# EasyEDA Pro project ProPrj_HPMDuino_DEV_2025-07-16.epro, schematic Schematic1
Board Name: Board1; Create Date: 2025-06-02; Page Name: P1; Project Name: HPMDuino_DEV; Schematic Name: Schematic1; Update Date: 2025-07-04; Drawed: Flose; Version: 1.0beta
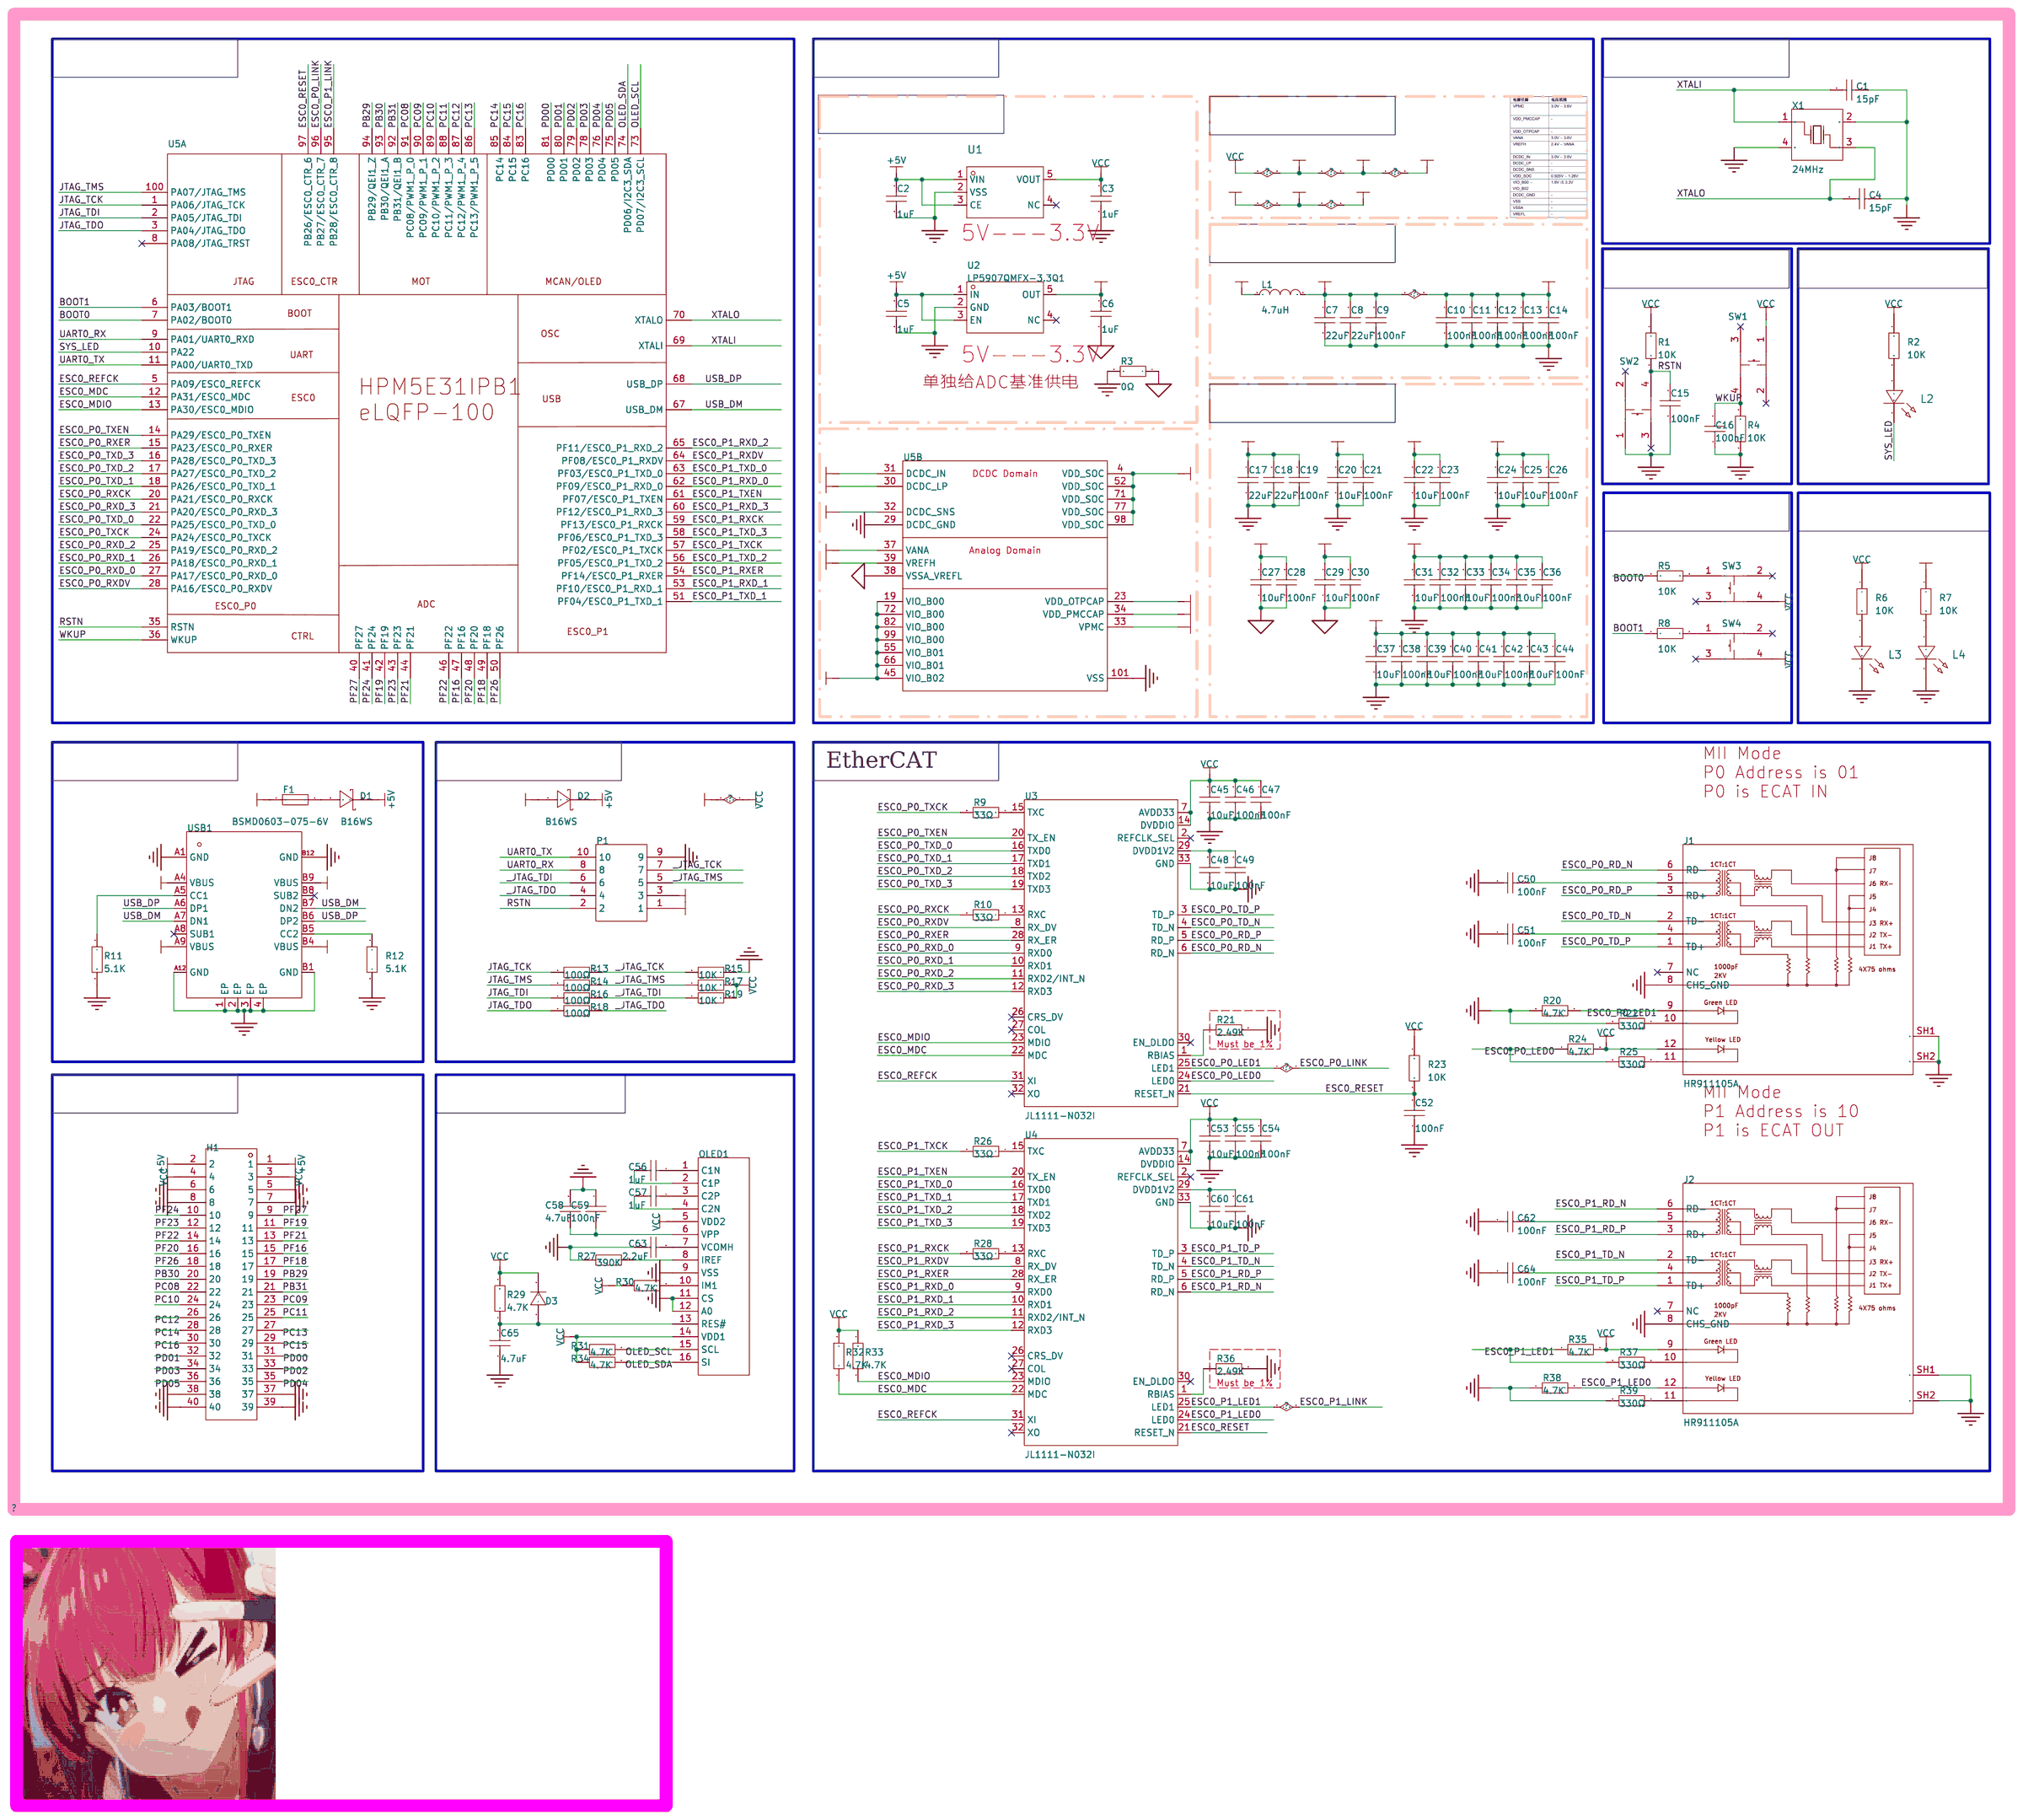
[diagram p0: schematic sheet]

## Parts
C1  15pF  [c0402-无丝印-全尺寸_2]
C2  1uF  [c0402-无丝印-全尺寸_2]
C3  1uF  [c0402-无丝印-全尺寸_2]
C4  15pF  [c0402-无丝印-全尺寸_2]
C5  1uF  [c0402-无丝印-全尺寸_2]
C6  1uF  [c0402-无丝印-全尺寸_2]
C7  22uF  [c0402-无丝印-全尺寸_2]
C8  22uF  [c0402-无丝印-全尺寸_2]
C9  100nF  [c0402-无丝印-全尺寸_2]
C10  100nF  [c0402-无丝印-全尺寸_2]
C11  100nF  [c0402-无丝印-全尺寸_2]
C12  100nF  [c0402-无丝印-全尺寸_2]
C13  100nF  [c0402-无丝印-全尺寸_2]
C14  100nF  [c0402-无丝印-全尺寸_2]
C15  100nF  [c0402-无丝印-全尺寸_2]
C16  100nF  [c0402-无丝印-全尺寸_2]
C17  22uF  [c0402-无丝印-全尺寸_2]
C18  22uF  [c0402-无丝印-全尺寸_2]
C19  100nF  [c0402-无丝印-全尺寸_2]
C20  10uF  [c0402-无丝印-全尺寸_2]
C21  100nF  [c0402-无丝印-全尺寸_2]
C22  10uF  [c0402-无丝印-全尺寸_2]
C23  100nF  [c0402-无丝印-全尺寸_2]
C24  10uF  [c0402-无丝印-全尺寸_2]
C25  10uF  [c0402-无丝印-全尺寸_2]
C26  100nF  [c0402-无丝印-全尺寸_2]
C27  10uF  [c0402-无丝印-全尺寸_2]
C28  100nF  [c0402-无丝印-全尺寸_2]
C29  10uF  [c0402-无丝印-全尺寸_2]
C30  100nF  [c0402-无丝印-全尺寸_2]
C31  10uF  [c0402-无丝印-全尺寸_2]
C32  100nF  [c0402-无丝印-全尺寸_2]
C33  10uF  [c0402-无丝印-全尺寸_2]
C34  100nF  [c0402-无丝印-全尺寸_2]
C35  10uF  [c0402-无丝印-全尺寸_2]
C36  100nF  [c0402-无丝印-全尺寸_2]
C37  10uF  [c0402-无丝印-全尺寸_2]
C38  100nF  [c0402-无丝印-全尺寸_2]
C39  10uF  [c0402-无丝印-全尺寸_2]
C40  100nF  [c0402-无丝印-全尺寸_2]
C41  10uF  [c0402-无丝印-全尺寸_2]
C42  100nF  [c0402-无丝印-全尺寸_2]
C43  10uF  [c0402-无丝印-全尺寸_2]
C44  100nF  [c0402-无丝印-全尺寸_2]
C45  10uF  [c0402-无丝印-全尺寸_2]
C46  100nF  [c0402-无丝印-全尺寸_2]
C47  100nF  [c0402-无丝印-全尺寸_2]
C48  10uF  [c0402-无丝印-全尺寸_2]
C49  100nF  [c0402-无丝印-全尺寸_2]
C50  100nF  [c0402-无丝印-全尺寸_2]
C51  100nF  [c0402-无丝印-全尺寸_2]
C52  100nF  [c0402-无丝印-全尺寸_2]
C53  10uF  [c0402-无丝印-全尺寸_2]
C54  100nF  [c0402-无丝印-全尺寸_2]
C55  100nF  [c0402-无丝印-全尺寸_2]
C56  1uF  [c0402-无丝印-全尺寸_2]
C57  1uF  [c0402-无丝印-全尺寸_2]
C58  4.7uF  [c0402-无丝印-全尺寸_2]
C59  100nF  [c0402-无丝印-全尺寸_2]
C60  10uF  [c0402-无丝印-全尺寸_2]
C61  100nF  [c0402-无丝印-全尺寸_2]
C62  100nF  [c0402-无丝印-全尺寸_2]
C63  2.2uF  [c0402-无丝印-全尺寸_2]
C64  100nF  [c0402-无丝印-全尺寸_2]
C65  4.7uF  [c0402-无丝印-全尺寸_2]
D1  B16WS  [SOD-323_L1.8-W1.3-LS2.5-RD]
D2  B16WS  [SOD-323_L1.8-W1.3-LS2.5-RD]
D3  1N4148WS  [SOD-323_L1.8-W1.3-LS2.5-RD]
F1  BSMD0603-075-6V  [F0603]
H1  -  [HDR-TH_40P-P2.54-V-M-R2-C20-S2.54]
J1  HR911105A  [RJ45-TH_HR911105A]
J2  HR911105A  [RJ45-TH_HR911105A]
L1  4.7uH  [IND-SMD_L2.5-W2.0-VLS252012CX-150M]
L2  NCD0603G1  [LED0603_S]
L3  NCD0603G1  [LED0603_S]
L4  NCD0603G1  [LED0603_S]
OLED1  -  [1.29'OLED-64x128-16P]
P1  2.0-2*5P直简牛  [IDC-TH_10P-P2.00-V-R2-C5-S2.00]
R1  10K  [r0402-无丝印-全尺寸_1]
R2  10K  [r0402-无丝印-全尺寸_1]
R3  0Ω  [r0402-无丝印-全尺寸_1]
R4  10K  [r0402-无丝印-全尺寸_1]
R5  10K  [r0402-无丝印-全尺寸_1]
R6  10K  [r0402-无丝印-全尺寸_1]
R7  10K  [r0402-无丝印-全尺寸_1]
R8  10K  [r0402-无丝印-全尺寸_1]
R9  33Ω  [r0402-无丝印-全尺寸_1]
R10  33Ω  [r0402-无丝印-全尺寸_1]
R11  5.1K  [r0402-无丝印-全尺寸_1]
R12  5.1K  [r0402-无丝印-全尺寸_1]
R13  100Ω  [r0402-无丝印-全尺寸_1]
R14  100Ω  [r0402-无丝印-全尺寸_1]
R15  10K  [r0402-无丝印-全尺寸_1]
R16  100Ω  [r0402-无丝印-全尺寸_1]
R17  10K  [r0402-无丝印-全尺寸_1]
R18  100Ω  [r0402-无丝印-全尺寸_1]
R19  10K  [r0402-无丝印-全尺寸_1]
R20  4.7K  [r0402-无丝印-全尺寸_1]
R21  2.49K  [r0402-无丝印-全尺寸_1]
R22  330Ω  [r0402-无丝印-全尺寸_1]
R23  10K  [r0402-无丝印-全尺寸_1]
R24  4.7K  [r0402-无丝印-全尺寸_1]
R25  330Ω  [r0402-无丝印-全尺寸_1]
R26  33Ω  [r0402-无丝印-全尺寸_1]
R27  390K  [r0402-无丝印-全尺寸_1]
R28  33Ω  [r0402-无丝印-全尺寸_1]
R29  4.7K  [r0402-无丝印-全尺寸_1]
R30  4.7K  [r0402-无丝印-全尺寸_1]
R31  4.7K  [r0402-无丝印-全尺寸_1]
R32  4.7K  [r0402-无丝印-全尺寸_1]
R33  4.7K  [r0402-无丝印-全尺寸_1]
R34  4.7K  [r0402-无丝印-全尺寸_1]
R35  4.7K  [r0402-无丝印-全尺寸_1]
R36  2.49K  [r0402-无丝印-全尺寸_1]
R37  330Ω  [r0402-无丝印-全尺寸_1]
R38  4.7K  [r0402-无丝印-全尺寸_1]
R39  330Ω  [r0402-无丝印-全尺寸_1]
SW1  PTS815SJK250SMTRLFS  [SW-SMD_4P-L4.2-W3.3-P2.15-LS5.1]
SW2  PTS815SJK250SMTRLFS  [SW-SMD_4P-L4.2-W3.3-P2.15-LS5.1]
SW3  PTS815SJK250SMTRLFS  [SW-SMD_4P-L4.2-W3.3-P2.15-LS5.1]
SW4  PTS815SJK250SMTRLFS  [SW-SMD_4P-L4.2-W3.3-P2.15-LS5.1]
U1  XC6210B332MR  [SOT-23-5_L3.0-W1.7-P0.95-LS2.8-BR]
U2  LP5907QMFX-3.3Q1  [SOT-23-5_L3.0-W1.7-P0.95-LS2.8-BR]
U3  JL1111-N032I  [QFN-32_L5.0-W5.0-P0.50-TL-EP3.3]
U4  JL1111-N032I  [QFN-32_L5.0-W5.0-P0.50-TL-EP3.3]
U5  -  [eLQFP-100]  (sections MAIN,PWR)
USB1  KH-TYPE-C-16P  [USB-C-SMD_KH-TYPE-C-16P]
X1  24MHz  [CRYSTAL-SMD_4P-L3.2-W2.5-BL]

## Library data of the parts
C1-C65 = CL05A106MQ5NUNC: 容值:10uF;精度:±20%;额定电压:6.3V;材质(温度系数):X5R;; LCSC Part Name: 10uF ±20% 6.3V; Supplier Part: C15525; Manufacturer: SAMSUNG(三星); Supplier Footprint: 0402; JLCPCB Part Class: Basic Part; Datasheet: https://atta.szlcsc.com/upload/public/pdf/source/20220823/2B02EE04F8F211D38A52DCB16EB6BEBA.pdf; Supplier: LCSC; Tolerance: ±20%; Voltage Rated: 6.3V; Temperature Coefficient: X5R
D1 D2 = B16WS_C364278: 正向压降(Vf):700mV@1A;直流反向耐压(Vr):40V;整流电流:1A;; LCSC Part Name: 电压:40V 电流:1A; Supplier Part: C364278; Manufacturer: MDD(辰达半导体); Supplier Footprint: SOD-323; JLCPCB Part Class: 扩展库; Datasheet: https://atta.szlcsc.com/upload/public/pdf/source/20240729/65CF7652994FB9489B656F4E1141E413.pdf; Supplier: LCSC; Forward Voltage (Vf@If): 700mV@1A; Reverse Voltage (Vr): 40V; Rectified Current: 1A; Reverse Leakage Current (Ir): 100uA@40V
D3 = 1N4148WS_C2128: 二极管配置:独立式;功率:200mW;直流反向耐压(Vr):100V;平均整流电流(Io):150mA;正向压降(Vf):1.25V@150mA;反向电流(Ir):1uA@75V;反向恢复时间(trr):4ns;工作温度:+150℃@(Tj);; LCSC Part Name: 100V 150mA 4ns T4; Supplier Part: C2128; Manufacturer: CJ(江苏长电/长晶); Supplier Footprint: SOD-323; JLCPCB Part Class: 基础库; Datasheet: https://atta.szlcsc.com/upload/public/pdf/source/20140809/1457707208178.pdf; Supplier: LCSC; Diode Configuration: 独立式; Power Dissipation: 200mW; Reverse Voltage (Vr): 100V; Average Rectified Current (Io): 150mA; Forward Voltage (Vf@If): 1.25V@150mA; Reverse Leakage Current: 1uA@75V; Reverse Recovery Time (trr): 4ns; Operating Temperature: +150℃@(Tj)
F1 = BSMD0603-075-6V: 最大电压:6V;最大电流:40A;保持电流:750mA;跳闸电流:1.5A;; LCSC Part Name: 6V 750mA 0603自恢复; Supplier Part: C914092; Manufacturer: BHFUSE(佰宏); Supplier Footprint: 0603; JLCPCB Part Class: 扩展库; Datasheet: https://atta.szlcsc.com/upload/public/pdf/source/20230512/E478DE3555A0061DA0124A9F45802B86.pdf; Supplier: LCSC; Operating Voltage (Max): 6V; Current Rating (Max): 40A; Hold Current: 750mA; Trip Current: 1.5A; Power Dissipation: 500mW; Resistance - Initial (Ri) (Min): 60mΩ; Resistance - Post Trip (R1) (Max): 450mΩ; Maximum Time to Trip: 100ms; Operating Temperature: -40℃~+85℃
H1 = B-2100S40P-B110: 间距:2.54mm;总PIN位数:40;排数:2;插针结构:2x20P;行距:2.54mm;安装类型:直插;圆针/方针:-;额定电流:-;额定电压:-;配合针长度:6mm;塑高:2.54mm;端接针长度:3mm;触头材质:黄铜;触头镀层:-;工作温度范围:-40~+105;颜色:黑色;; LCSC Part Name: 2.54mm 2x20P; Supplier Part: C124383; Manufacturer: Ckmtw(灿科盟); Supplier Footprint: 插件,P=2.54mm; JLCPCB Part Class: Extended Part; Datasheet: https://atta.szlcsc.com/upload/public/pdf/source/20170821/C124383_1503303310291901537.pdf; Supplier: LCSC; Pitch: 2.54mm; Number of Pins: 40; Number of Rows: 2; Pin Structure: 2x20P; Row Spacing: 2.54mm; Mounting Type: 直插; Length of Mating Pin: 6mm; Insulation Height: 2.54mm; Length of End Connection Pin: 3mm; Contact Material: 黄铜; Operating Temperature Range: -40~+105; Color: 黑色
J1 J2 = HR911105A_C12074: 连接器类型:RJ插座;USOC代码:RJ45;端口数量:1;等级:-;屏蔽:-;LED:带LED;; LCSC Part Name: RJ45 带LED 带LED灯; Supplier Part: C12074; Manufacturer: HANRUN(汉仁); Supplier Footprint: 插件; JLCPCB Part Class: 扩展库; Datasheet: https://atta.szlcsc.com/upload/public/pdf/source/20170918/C12074_1505726819496976146.pdf; Supplier: LCSC; Connector Type: RJ插座; USOC Codes: RJ45; Number of Ports: 1; LED: 带LED
L1 = FTC252010S4R7MBCA: 电感值:4.7uH;精度:±20%;额定电流:2A;饱和电流(Isat):2.6A;类型:一体成型电感;; LCSC Part Name: 4.7uH ±20% 2.6A; Supplier Part: C5832360; Manufacturer: cjiang(长江微电); Supplier Footprint: SMD,2x2.5mm; JLCPCB Part Class: 扩展库; Datasheet: https://atta.szlcsc.com/upload/public/pdf/source/20230602/8FFEDA9C0247A92A0D4B67554BFE4091.pdf; Supplier: LCSC; Tolerance: ±20%; Rated Current: 2A; Saturation Current (Isat): 2.6A; DC Resistance (DCR): 160mΩ; Type: 一体成型电感
L2-L4 = NCD0603G1: 发光颜色:翠绿色;功率:72mW;透镜颜色:无色透明;主波长:515nm~530nm;发光强度:330mcd~900mcd;发光角度:130°;工作温度:-30℃~+85℃;; LCSC Part Name: 翠绿 0603翠绿  正贴; Supplier Part: C84267; Manufacturer: 国星光电; Supplier Footprint: 0603; JLCPCB Part Class: Extended Part; Datasheet: https://atta.szlcsc.com/upload/public/pdf/source/20200820/C84267_04BA7703640BAC111D09F5EFB971FBF3.pdf; Supplier: LCSC; Emitted Color: 翠绿色; Forward Voltage (VF): 2.6V~3.6V; Forward Current: 10mA; Power Dissipation: 72mW; Lens Color: 无色透明; Dominant Wavelength: 515nm~530nm; Luminous Intensity: 330mcd~900mcd; Viewing Angle: 130°; Operating Temperature: -30℃~+85℃; Check: true
OLED1 = 中景园_1.29寸OLED
P1 = 2.0-2*5P直简牛: 连接器类型:简牛座;间距:2mm;结构:2x5P;封装形式:直插;行距:2mm;排数:2;每排PIN数:5;触头材质:-;触头镀层:-;; LCSC Part Name: 2mm 2x5P 排数:2 每排P数:5; Supplier Part: C5661; Manufacturer: BOOMELE(博穆精密); Supplier Footprint: 插件,P=2mm; JLCPCB Part Class: 扩展库; Datasheet: https://atta.szlcsc.com/upload/public/pdf/source/20151118/1457707581337.pdf; Supplier: LCSC; Connector Type: 简牛座; Pitch: 2mm; Structure: 2x5P; Holder Type: 直插; Row Spacing: 2mm; Number of Rows: 2; Pin Number in each Row: 5
R1-R39 = 0402WGF1002TCE: 电阻类型:厚膜电阻;阻值:10kΩ;精度:±1%;功率:62.5mW;最大工作电压:50V;温度系数:±100ppm/℃;; LCSC Part Name: 10kΩ ±1% 62.5mW 厚膜电阻; Supplier Part: C25744; Manufacturer: UNI-ROYAL(厚声); Supplier Footprint: 0402; JLCPCB Part Class: 基础库; Datasheet: https://atta.szlcsc.com/upload/public/pdf/source/20200306/C422600_1E6D84923E4A46A82E41ADD87F860B5C.pdf; Supplier: LCSC; Type: 厚膜电阻; Tolerance: ±1%; Power(Watts): 62.5mW; Overload Voltage (Max): 50V; Temperature Coefficient: ±100ppm/℃; Operating Temperature Range: -55℃~+155℃
SW1-SW4 = PTS815SJK250SMTRLFS: 电路结构:单刀单掷-常开;按钮形状:椭圆形按钮;触点电流:50mA;额定电压(DC):12V;安装方式:立贴;作用力:250gf;; LCSC Part Name: 轻触开关; Supplier Part: C918859; Manufacturer: C&K; Supplier Footprint: SMD; JLCPCB Part Class: 扩展库; Datasheet: https://atta.szlcsc.com/upload/public/pdf/source/20190916/C411883_4F77F16E1D8E48DC707D8949CEE7CF80.pdf; Supplier: LCSC; Circuit: 单刀单掷-常开; Actuator Style: 椭圆形按钮; Contact Current: 50mA; Voltage Rating (DC): 12V; Mounting Style: 立贴; Operating Force: 250gf; IP Rating: IP40; Pin Style: J型引脚; Operating Temperature: -20℃~+70℃
U1 = XC6210B332MR_C424705: 输出类型:固定;输出极性:正;最大输入电压:6V;输出电压:3.3V;输出电流:900mA;电源纹波抑制比(PSRR):60dB@(1kHz);; Supplier Part: C424705; Manufacturer: TOREX(特瑞仕); Supplier Footprint: SOT-25; JLCPCB Part Class: Extended Part; Datasheet: https://atta.szlcsc.com/upload/public/pdf/source/20190903/C424705_1DFB2113A9A78D399905DBF688657204.pdf; Supplier: LCSC; Output Type: 固定; Output Polarity: 正; Number of Outputs: 1; Maximum Input Voltage: 6V; Output Voltage: 3.3V; Dropout Voltage: 75mV@(100mA); Output Current: 900mA; Power Supply Rejection Ratio (PSRR): 60dB@(1kHz); Power Supply Rejection Ratio (PRSS): 90dB@(100Hz),60dB@(100kHz); Check: true
U2 = LP5907QMFX-3.3Q1: 输出类型:固定;输出极性:正;最大输入电压:5.5V;输出电压:3.3V;输出电流:250mA;电源纹波抑制比(PSRR):90dB;; Supplier Part: C130005; Manufacturer: TI(德州仪器); Supplier Footprint: SOT-23-5; JLCPCB Part Class: Extended Part; Datasheet: https://atta.szlcsc.com/upload/public/pdf/source/20170918/C130005_1505703244961975089.pdf; Supplier: LCSC; Output Type: 固定; Output Polarity: 正; Number of Outputs: 1; Maximum Input Voltage: 5.5V; Output Voltage: 3.3V; Dropout Voltage: 250mV@(250mA); Output Current: 250mA; Power Supply Rejection Ratio (PSRR): 90dB; Power Supply Rejection Ratio (PRSS): 90dB@(100Hz),60dB@(100kHz); Check: true
U3 U4 = JL1111-N032I: 适合HPM5E的EtherCAT端口使用的PHY; Manufacturer: 景略
U5 = HPM5E31IPB1_Block: Manufacturer: HPMicro(先楫半导体)
USB1 = KH-TYPE-C-16P: 连接器类型:Type-C;标准:-;公母:母;端口数量:1;触点数量:16P;安装方式:卧贴;额定电流 - 电源:3A;工作温度范围:-40℃~+85℃;; LCSC Part Name: Type-C 母 卧贴; Supplier Part: C709357; Manufacturer: kinghelm(金航标); Supplier Footprint: SMD; JLCPCB Part Class: 扩展库; Datasheet: https://atta.szlcsc.com/upload/public/pdf/source/20200911/C709357_AA8DCEB38BB20E3035A7ED7AE7667837.pdf; Supplier: LCSC; Connector Type: Type-C; Gender: 母; Number of Ports: 1; Number of Contacts: 16P; Mounting Style: 卧贴; Current Rating - Power (Max): 3A; Operating Temperature Range: -40℃~+85℃
X1 = X322524MOB4SI: 晶振类型:贴片晶振;频率:24MHz;常温频差:±10ppm;外接负载电容:12pF;频率稳定度(全温):±20ppm;; LCSC Part Name: 24MHz ±10ppm 12pF; Supplier Part: C70590; Manufacturer: YXC(扬兴晶振); Supplier Footprint: SMD3225-4P; JLCPCB Part Class: 扩展库; Datasheet: https://atta.szlcsc.com/upload/public/pdf/source/20240329/19D5F850207469550BEB00D7DFEDBC7A.pdf; Supplier: LCSC; Crystal Type: 贴片晶振; Normal temperature Frequency Tolerance: ±10ppm; External load capacitor: 12pF; Frequency Stability(Full temperature range): ±20ppm; Operating Temperature: -40℃~+85℃

## Nets
+5V: C2.2 C5.2 D1.1 D2.1 H1.1 H1.2 U1.1(VIN) U1.3(CE) U2.1(IN) U2.3(EN)
AGND: C6.1 C27.1 C28.1 C29.1 C30.1 R3.1 U5.38(VSSA_VREFL)
AVCC: C6.2 C27.2 C28.2 C29.2 C30.2 R7.1 U2.5(OUT) U5.37(VANA) U5.39(VREFH)
GND: C1.1 C2.1 C3.1 C4.1 C5.1 C7.1 C8.1 C9.1 C10.1 C11.1 C12.1 C13.1 C14.1 C15.1 C16.1 C17.1 C18.1 C19.1 C20.1 C21.1 C22.1 C23.1 C24.1 C25.1 C26.1 C31.1 C32.1 C33.1 C34.1 C35.1 C36.1 C37.1 C38.1 C39.1 C40.1 C41.1 C42.1 C43.1 C44.1 C45.1 C46.1 C47.1 C48.1 C49.1 C50.2 C51.2 C52.1 C53.1 C54.1 C55.1 C58.2 C59.1 C60.1 C61.1 C62.2 C63.1 C64.2 C65.1 H1.5 H1.6 H1.7 H1.8 H1.37 H1.38 H1.39 H1.40 J1.8(CHS GND) J1.SH1 J1.SH2 J2.8(CHS GND) J2.SH1 J2.SH2 L3.2 L4.2 OLED1.9(VSS) OLED1.11(CS) OLED1.12(A0) P1.9 R3.2 R4.1 R11.2 R12.2 R15.2 R20.1 R21.2 R22.1 R27.1 R36.2 R38.1 R39.1 SW2.1 U1.2(VSS) U2.2(GND) U3.33(GND) U4.33(GND) U5.29(DCDC_GND) U5.101(VSS) USB1.1(EP) USB1.2(EP) USB1.3(EP) USB1.4(EP) USB1.A1(GND) USB1.A12(GND) USB1.B1(GND) USB1.B12(GND) X1.2(GND) X1.4(GND)
VBUS: F1.1 USB1.A4(VBUS) USB1.A9(VBUS) USB1.B4(VBUS) USB1.B9(VBUS)
VDD_OTPCAP: C22.2 C23.2 U5.23(VDD_OTPCAP)
VDD_PMCCAP: C24.2 C25.2 C26.2 U5.34(VDD_PMCCAP)
_JTAG_TCK: P1.7 R13.1 R15.1
_JTAG_TDI: P1.6 R16.1 R19.1
_JTAG_TDO: P1.4 R18.1
_JTAG_TMS: P1.5 R14.1 R17.1
BOOT0: R5.1 U5.7(PA02/BOOT0)
BOOT1: R8.1 U5.6(PA03/BOOT1)
DCDC_IN: C3.2 C17.2 C18.2 C19.2 C20.2 C21.2 C31.2 C32.2 C33.2 C34.2 C35.2 C36.2 C37.2 C38.2 C39.2 C40.2 C41.2 C42.2 C43.2 C44.2 C45.2 C46.2 C47.2 C53.2 C54.2 C55.2 D3.1(K) H1.3 H1.4 J1.12 J2.9 OLED1.5(VDD2) OLED1.14(VDD1) P1.3 R1.1 R2.1 R6.1 R17.2 R19.2 R23.1 R24.2 R29.2 R30.1 R31.1 R32.2 R33.2 R34.1 R35.2 SW1.1 SW3.4 SW4.4 U1.5(VOUT) U3.7(AVDD33) U3.14(DVDDIO) U4.7(AVDD33) U4.14(DVDDIO) U5.19(VIO_B00) U5.31(DCDC_IN) U5.33(VPMC) U5.45(VIO_B02) U5.55(VIO_B01) U5.66(VIO_B01) U5.72(VIO_B00) U5.82(VIO_B00) U5.99(VIO_B00)
DCDC_LP: L1.1 U5.30(DCDC_LP)
DCDC_SNS: C7.2 C8.2 C9.2 C10.2 C11.2 C12.2 C13.2 C14.2 L1.2 U5.4(VDD_SOC) U5.32(DCDC_SNS) U5.52(VDD_SOC) U5.71(VDD_SOC) U5.77(VDD_SOC) U5.98(VDD_SOC)
ESC0_MDC: R32.1 U3.22(MDC) U4.22(MDC) U5.12(PA31/ESC0_MDC)
ESC0_MDIO: R33.1 U3.23(MDIO) U4.23(MDIO) U5.13(PA30/ESC0_MDIO)
ESC0_P0_LED0: R24.1 R25.1 U3.24(LED0)
ESC0_P0_LED1: J1.9 R20.2 U3.25(LED1) U5.96(PB27/ESC0_CTR_7)
ESC0_P0_RD_N: J1.6(RD-) U3.6(RD_N)
ESC0_P0_RD_P: J1.3(RD+) U3.5(RD_P)
ESC0_P0_RXCK: R10.2 U5.20(PA21/ESC0_P0_RXCK)
ESC0_P0_RXD_0: U3.9(RXD0) U5.27(PA17/ESC0_P0_RXD_0)
ESC0_P0_RXD_1: U3.10(RXD1) U5.26(PA18/ESC0_P0_RXD_1)
ESC0_P0_RXD_2: U3.11(RXD2/INT_N) U5.25(PA19/ESC0_P0_RXD_2)
ESC0_P0_RXD_3: U3.12(RXD3) U5.21(PA20/ESC0_P0_RXD_3)
ESC0_P0_RXDV: U3.8(RX_DV) U5.28(PA16/ESC0_P0_RXDV)
ESC0_P0_RXER: U3.28(RX_ER) U5.15(PA23/ESC0_P0_RXER)
ESC0_P0_TD_N: J1.2(TD-) U3.4(TD_N)
ESC0_P0_TD_P: J1.1(TD+) U3.3(TD_P)
ESC0_P0_TXCK: R9.2 U5.24(PA24/ESC0_P0_TXCK)
ESC0_P0_TXD_0: U3.16(TXD0) U5.22(PA25/ESC0_P0_TXD_0)
ESC0_P0_TXD_1: U3.17(TXD1) U5.18(PA26/ESC0_P0_TXD_1)
ESC0_P0_TXD_2: U3.18(TXD2) U5.17(PA27/ESC0_P0_TXD_2)
ESC0_P0_TXD_3: U3.19(TXD3) U5.16(PA28/ESC0_P0_TXD_3)
ESC0_P0_TXEN: U3.20(TX_EN) U5.14(PA29/ESC0_P0_TXEN)
ESC0_P1_LED0: J2.12 R38.2 U4.24(LED0)
ESC0_P1_LED1: R35.1 R37.1 U4.25(LED1) U5.95(PB28/ESC0_CTR_8)
ESC0_P1_RD_N: J2.6(RD-) U4.6(RD_N)
ESC0_P1_RD_P: J2.3(RD+) U4.5(RD_P)
ESC0_P1_RXCK: R28.2 U5.59(PF13/ESC0_P1_RXCK)
ESC0_P1_RXD_0: U4.9(RXD0) U5.62(PF09/ESC0_P1_RXD_0)
ESC0_P1_RXD_1: U4.10(RXD1) U5.53(PF10/ESC0_P1_RXD_1)
ESC0_P1_RXD_2: U4.11(RXD2/INT_N) U5.65(PF11/ESC0_P1_RXD_2)
ESC0_P1_RXD_3: U4.12(RXD3) U5.60(PF12/ESC0_P1_RXD_3)
ESC0_P1_RXDV: U4.8(RX_DV) U5.64(PF08/ESC0_P1_RXDV)
ESC0_P1_RXER: U4.28(RX_ER) U5.54(PF14/ESC0_P1_RXER)
ESC0_P1_TD_N: J2.2(TD-) U4.4(TD_N)
ESC0_P1_TD_P: J2.1(TD+) U4.3(TD_P)
ESC0_P1_TXCK: R26.2 U5.57(PF02/ESC0_P1_TXCK)
ESC0_P1_TXD_0: U4.16(TXD0) U5.63(PF03/ESC0_P1_TXD_0)
ESC0_P1_TXD_1: U4.17(TXD1) U5.51(PF04/ESC0_P1_TXD_1)
ESC0_P1_TXD_2: U4.18(TXD2) U5.56(PF05/ESC0_P1_TXD_2)
ESC0_P1_TXD_3: U4.19(TXD3) U5.58(PF06/ESC0_P1_TXD_3)
ESC0_P1_TXEN: U4.20(TX_EN) U5.61(PF07/ESC0_P1_TXEN)
ESC0_REFCK: U3.31(XI) U4.31(XI) U5.5(PA09/ESC0_REFCK)
ESC0_RESET: C52.2 R23.2 U3.21(RESET_N) U4.21(RESET_N) U5.97(PB26/ESC0_CTR_6)
JTAG_TCK: R13.2 U5.1(PA06/JTAG_TCK)
JTAG_TDI: R16.2 U5.2(PA05/JTAG_TDI)
JTAG_TDO: R18.2 U5.3(PA04/JTAG_TDO)
JTAG_TMS: R14.2 U5.100(PA07/JTAG_TMS)
JTAG_VDD: D2.2 P1.1
OLED_SCL: OLED1.15(SCL) R31.2 U5.73(PD07/I2C3_SCL)
OLED_SDA: OLED1.16(SI) R34.2 U5.74(PD06/I2C3_SDA)
PB29: H1.19 U5.94(PB29/QEI1_Z)
PB30: H1.20 U5.93(PB30/QEI1_A)
PB31: H1.21 U5.92(PB31/QEI1_B)
PC08: H1.22 U5.91(PC08/PWM1_P_0)
PC09: H1.23 U5.90(PC09/PWM1_P_1)
PC10: H1.24 U5.89(PC10/PWM1_P_2)
PC11: H1.25 U5.88(PC11/PWM1_P_3)
PC12: H1.26 U5.87(PC12/PWM1_P_4)
PC13: H1.27 U5.86(PC13/PWM1_P_5)
PC14: H1.28 U5.85(PC14)
PC15: H1.29 U5.84(PC15)
PC16: H1.30 U5.83(PC16)
PD00: H1.31 U5.81(PD00)
PD01: H1.32 U5.80(PD01)
PD02: H1.33 U5.79(PD02)
PD03: H1.34 U5.78(PD03)
PD04: H1.35 U5.76(PD04)
PD05: H1.36 U5.75(PD05)
PF16: H1.15 U5.47(PF16)
PF18: H1.17 U5.49(PF18)
PF19: H1.11 U5.42(PF19)
PF20: H1.16 U5.48(PF20)
PF21: H1.13 U5.44(PF21)
PF22: H1.14 U5.46(PF22)
PF23: H1.12 U5.43(PF23)
PF24: H1.10 U5.41(PF24)
PF26: H1.18 U5.50(PF26)
PF27: H1.9 U5.40(PF27)
RSTN: C15.2 P1.2 R1.2 SW2.4 U5.35(RSTN)
SYS_LED: L2.2 U5.10(PA22)
UART0_RX: P1.8 U5.9(PA01/UART0_RXD)
UART0_TX: P1.10 U5.11(PA00/UART0_TXD)
USB_DM: U5.67(USB_DM) USB1.A7(DN1) USB1.B7(DN2)
USB_DP: U5.68(USB_DP) USB1.A6(DP1) USB1.B6(DP2)
WKUP: C16.2 R4.2 SW1.4 U5.36(WKUP)
XTALI: C1.2 U5.69(XTALI) X1.1(OSC1)
XTALO: C4.2 U5.70(XTALO) X1.3(OSC2)
$1N11759: R12.1 USB1.B5(CC2)
$1N11763: R11.1 USB1.A5(CC1)
$1N18295: R9.1 U3.15(TXC)
$1N18373: R10.1 U3.13(RXC)
$1N18412: R26.1 U4.15(TXC)
$1N18451: R28.1 U4.13(RXC)
$1N18860: C48.2 C49.2 U3.29(DVDD1V2)
$1N19227: R21.1 U3.1(RBIAS)
$1N19752: C60.2 C61.2 U4.29(DVDD1V2)
$1N19885: R36.1 U4.1(RBIAS)
$1N20086: C50.1 J1.5
$1N20091: C51.1 J1.4
$1N20598: C62.1 J2.5
$1N20602: C64.1 J2.4
$1N20817: J2.10 R37.2
$1N20822: J2.11 R39.2
$1N24058: L2.1 R2.2
$1N37197: C56.1 OLED1.1(C1N)
$1N37201: C56.2 OLED1.2(C1P)
$1N37238: C57.1 OLED1.3(C2P)
$1N37242: C57.2 OLED1.4(C2N)
$1N37324: C58.1 C59.2 OLED1.6(VPP)
$1N37461: C63.2 OLED1.7(VCOMH)
$1N37500: OLED1.8(IREF) R27.2
$1N40416: OLED1.10(IM1) R30.2
$1N46347: C65.2 D3.2(A) OLED1.13(RES#) R29.1
$1N46902: R5.2 SW3.1
$1N61081: L3.1 R6.2
$1N61162: L4.1 R7.2
$1N72423: R8.2 SW4.1
$1N88332: D1.2 F1.2
$1N115083: J1.11 R25.2
$1N115123: J1.10 R22.2

Not connected (* = marked no-connect by the designer): J1 7(NC)*; J2 7(NC)*; SW1 2* 3*; SW2 2* 3*; SW3 2* 3*; SW4 2* 3*; U1 4(NC)*; U2 4(NC)*; U3 2(REFCLK_SEL)* 26(CRS_DV)* 27(COL)* 30(EN_DLDO)* 32(XO)*; U4 2(REFCLK_SEL)* 26(CRS_DV)* 27(COL)* 30(EN_DLDO)* 32(XO)*; U5 8(PA08/JTAG_TRST)*; USB1 A8(SUB1)* B8(SUB2)*

## Notes on the sheet
- MCU
- PWR
- OSC
- OSC
- LDO
- PWRTREE
- 5V---3.3V
- INSIDE_DCDC
- FUNC_KEY
- OSC
- SYS_LED
- OSC
- 5V---3.3V
- 单独给ADC基准供电
- FILTER
- BOOT_SEL
- OSC
- PWR_LED
- OSC
- USB
- JTAG 10PIN
- EtherCAT
- MII Mode
  P0 Address is 01
  P0 is ECAT IN
- Must be 1%
- BOOT
- EXTRA PIN
- OLED 1.29
- OSC
- MII Mode
  P1 Address is 10
  P1 is ECAT OUT
- Must be 1%
